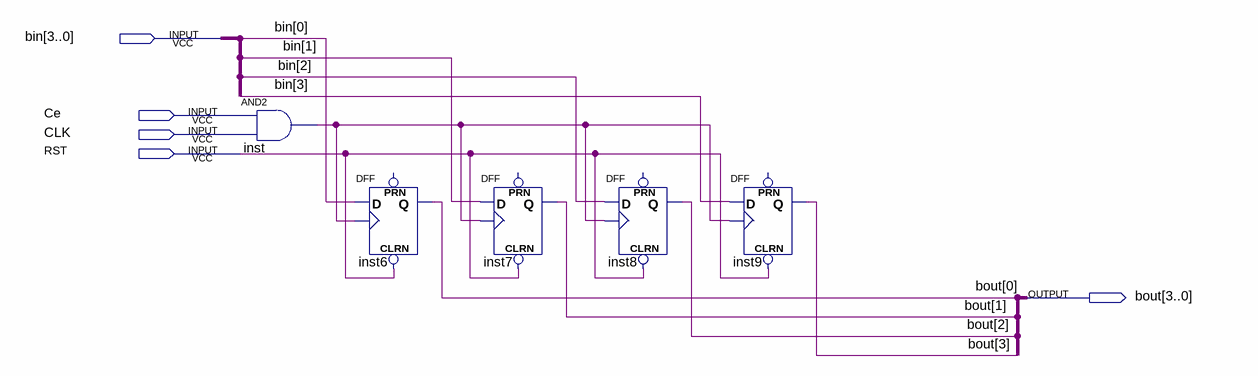
[diagram p0: schematic sheet]
// Quartus schematic FourBitsRegister.bdf as structural Verilog: 5 symbols, 5 pins
module FourBitsRegister (
  input  [3:0] bin,
  input  Ce,
  input  CLK,
  input  RST,
  output [3:0] bout
);

  wire inst_out;

  and inst (inst_out, Ce, CLK);
  DFF inst6 (.CLRN(RST), .CLK(inst_out), .D(bin[0]), .Q(bout[0]));  // open: PRN
  DFF inst7 (.CLRN(RST), .CLK(inst_out), .D(bin[1]), .Q(bout[1]));  // open: PRN
  DFF inst8 (.CLRN(RST), .CLK(inst_out), .D(bin[2]), .Q(bout[2]));  // open: PRN
  DFF inst9 (.CLRN(RST), .CLK(inst_out), .D(bin[3]), .Q(bout[3]));  // open: PRN
endmodule
